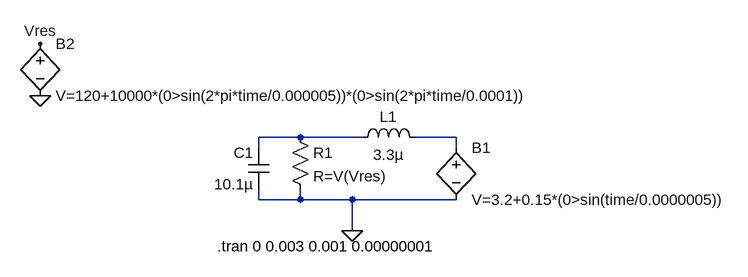
[diagram p0: schematic PowerSupply.asc]
PowerSupply.asc, the LTspice schematic file:
Version 4
SHEET 1 880 680
WIRE 112 128 48 128
WIRE 208 128 112 128
WIRE 352 128 288 128
WIRE 48 144 48 128
WIRE 352 144 352 128
WIRE 48 224 48 208
WIRE 112 224 112 208
WIRE 112 224 48 224
WIRE 192 224 112 224
WIRE 352 224 192 224
WIRE 192 272 192 224
FLAG 192 272 0
FLAG -288 64 0
FLAG -288 -16 Vres
SYMBOL cap 64 208 R180
WINDOW 0 24 56 Left 2
WINDOW 3 24 8 Left 2
SYMATTR InstName C1
SYMATTR Value 10.1µ
SYMBOL ind 192 144 R270
WINDOW 0 32 56 VTop 2
WINDOW 3 5 56 VBottom 2
SYMATTR InstName L1
SYMATTR Value 3.3µ
SYMATTR SpiceLine Ipk=50m Rser=0.6
SYMBOL bv 352 128 R0
SYMATTR InstName B1
SYMATTR Value V=3.2+0.15*(0>sin(time/0.0000005))
SYMBOL res 96 112 R0
SYMATTR InstName R1
SYMATTR Value R=V(Vres)
SYMBOL bv -288 -32 R0
SYMATTR InstName B2
SYMATTR Value V=120+10000*(0>sin(2*pi*time/0.000005))*(0>sin(2*pi*time/0.0001))
TEXT -16 296 Left 2 !.tran 0 0.003 0.001 0.00000001

The netlist it stands for:
* PowerSupply.asc
C1 0 N001 10.1µ
L1 N001 N002 3.3µ Ipk=50m Rser=0.6
B1 N002 0 V=3.2+0.15*(0>sin(time/0.0000005))
R1 N001 0 R=V(Vres)
B2 Vres 0 V=120+10000*(0>sin(2*pi*time/0.000005))*(0>sin(2*pi*time/0.0001))
.tran 0 0.003 0.001 0.00000001
.backanno
.end